# EAGLE design McManis_BJT_H-Bridge_v006 (EAGLE 7.1.0)
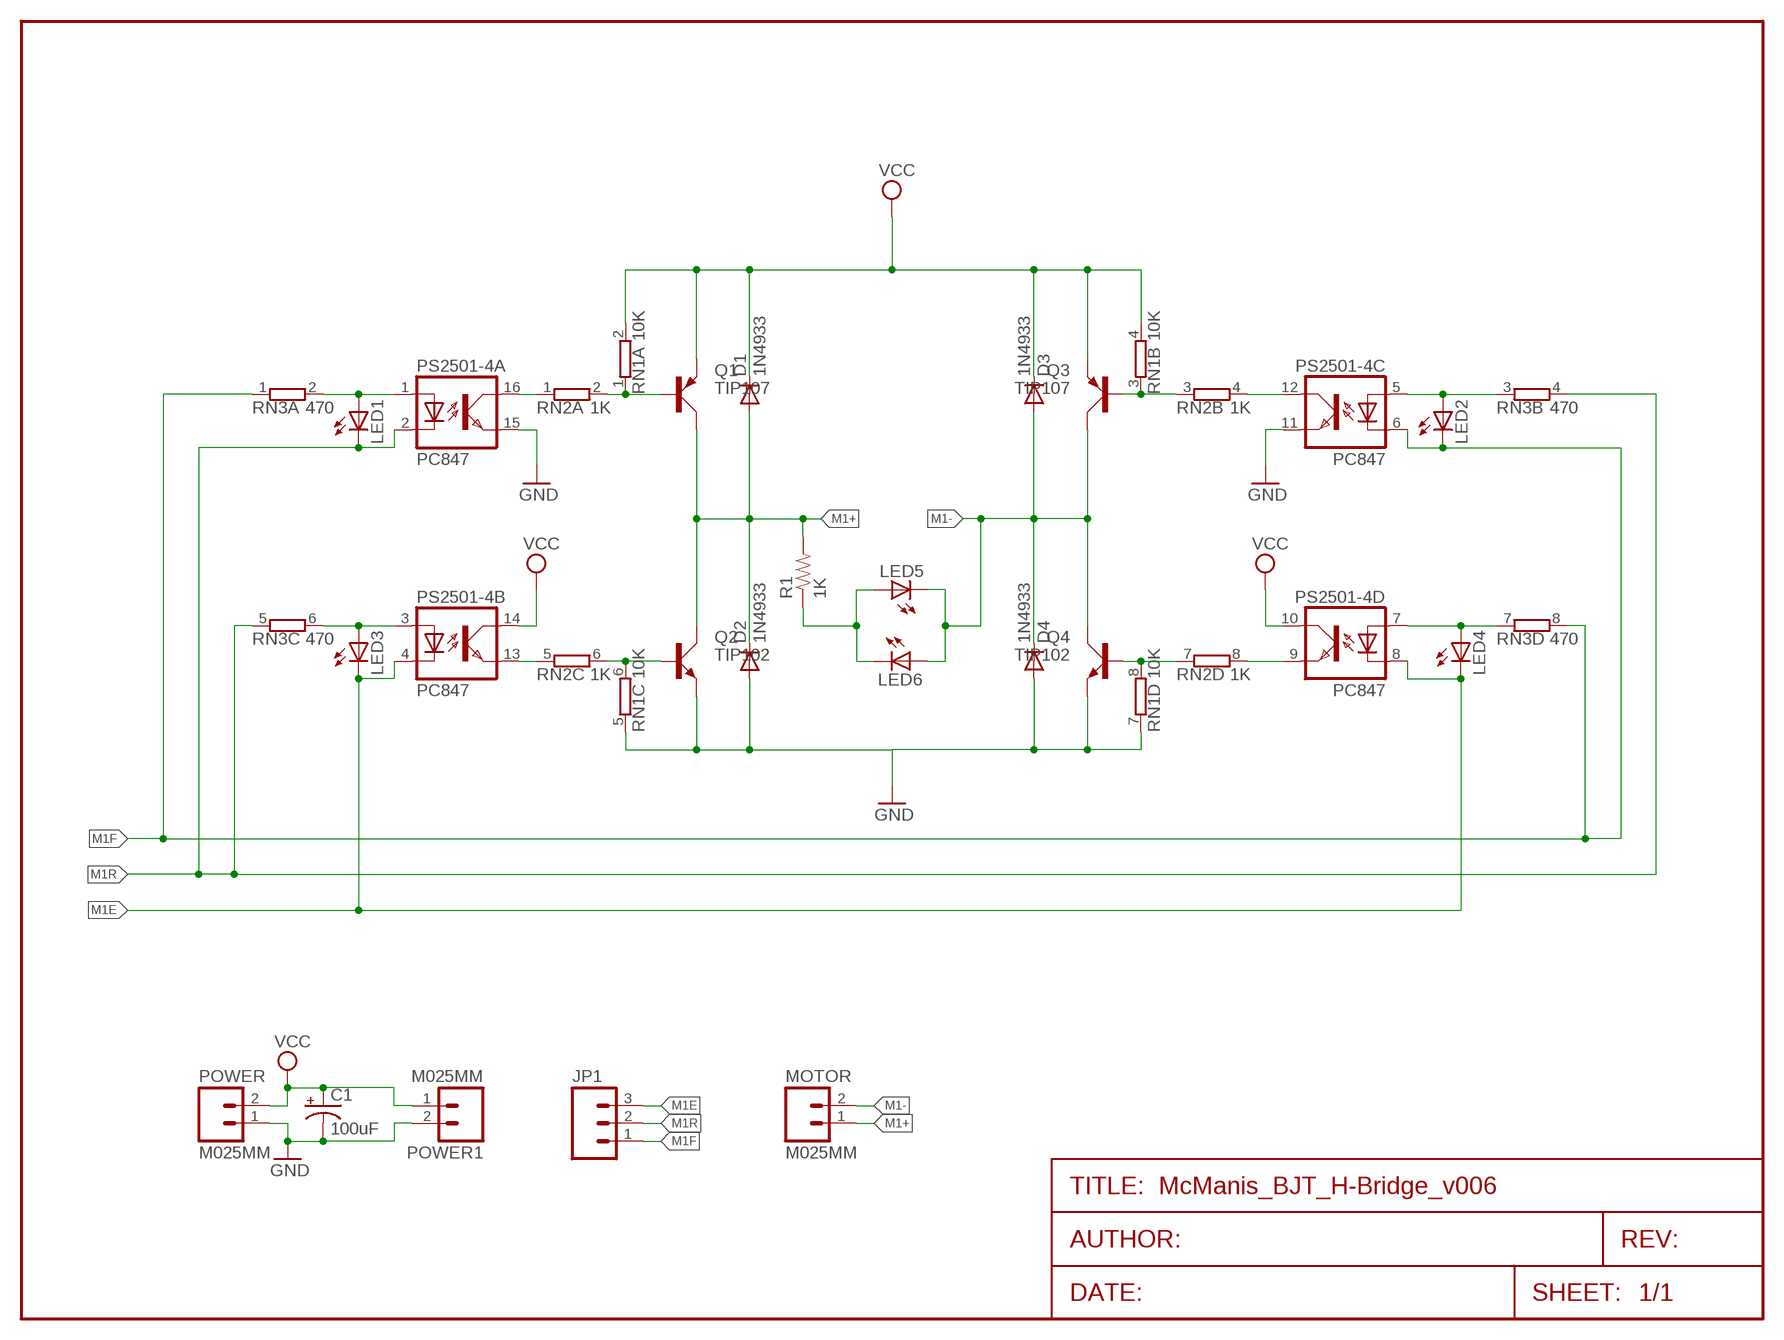
[diagram p0: schematic, sheet 1]

## Parts
C1  100uF  CAP_POLPTH1  [CPOL-RADIAL-100UF-25V]
D1  1N4933  [DO41-10]
D2  1N4933  [DO41-10]
D3  1N4933  [DO41-10]
D4  1N4933  [DO41-10]
JP1  M03PTH  [1X03]
LED1  LED3MM  [LED3MM]
LED2  LED3MM  [LED3MM]
LED3  LED3MM  [LED3MM]
LED4  LED3MM  [LED3MM]
LED5  LED3MM  [LED3MM]
LED6  LED3MM  [LED3MM]
MOTOR  M025MM  [SCREWTERMINAL-5MM-2]
POWER  M025MM  [SCREWTERMINAL-5MM-2]
POWER1  M025MM  [SCREWTERMINAL-5MM-2]
PS2501-4  PC847  [DIL16]
Q1  TIP107  TIP42C  [TO220AV]
Q2  TIP102  TIP41C  [TO220AV]
Q3  TIP107  TIP42C  [TO220AV]
Q4  TIP102  TIP41C  [TO220AV]
R1  1K  RESISTORPTH-1/4W  [AXIAL-0.4]
RN1  10K  E4R  [SIL8]
RN2  1K  E4R  [SIL8]
RN3  470  E4R  [SIL8]

## Nets
GND [Power]: C1.2(-) D2.A D4.A POWER1.2 POWER.1 PS2501-4.11(C:EMIT) PS2501-4.15(A:EMIT) Q2.E Q4.E RN1.5 RN1.7
M1+ [Power]: D1.A D2.C MOTOR.1 Q1.C Q2.C R1.P$2
M1- [Power]: D3.A D4.C LED5.K(C) LED6.A MOTOR.2 Q3.C Q4.C
M1E: JP1.3 LED3.K(C) LED4.K(C) PS2501-4.4(B:C) PS2501-4.8(D:C)
M1F: JP1.1 LED2.K(C) PS2501-4.6(C:C) RN3.1 RN3.8
M1R: JP1.2 LED1.K(C) PS2501-4.2(A:C) RN3.4 RN3.5
N$1: Q2.B RN1.6 RN2.6
N$2: Q1.B RN1.1 RN2.2
N$3: PS2501-4.16(A:COL) RN2.1
N$4: PS2501-4.13(B:EMIT) RN2.5
N$5: Q4.B RN1.8 RN2.7
N$6: Q3.B RN1.3 RN2.3
N$7: PS2501-4.9(D:EMIT) RN2.8
N$8: PS2501-4.12(C:COL) RN2.4
N$9: LED1.A PS2501-4.1(A:A) RN3.2
N$10: LED3.A PS2501-4.3(B:A) RN3.6
N$11: LED4.A PS2501-4.7(D:A) RN3.7
N$12: LED2.A PS2501-4.5(C:A) RN3.3
N$17: LED5.A LED6.K(C) R1.P$1
VCC [Power]: C1.1(+) D1.C D3.C POWER1.1 POWER.2 PS2501-4.10(D:COL) PS2501-4.14(B:COL) Q1.E Q3.E RN1.2 RN1.4

## Library data of the parts
C1 = SparkFun-Passives:CAP_POL: Capacitor Polarized These are standard SMD and PTH capacitors. Normally 10uF, 47uF, and 100uF in electrolytic and tantalum varieties. Always verify the external diameter of the through hole cap, it varies with capacity, voltage, and manufacturer. The EIA devices should be standard.
D1-D4 = diode:1N4933: DIODE fast recovery rectifier, 1A
JP1 = SparkFun-Connectors:M03: Header 3 Standard 3-pin 0.1" header. Use with straight break away headers (SKU : PRT-00116), right angle break away headers (PRT-00553), swiss pins (PRT-00743), machine pins (PRT-00117), and female headers (PRT-00115). Molex polarized connector foot print use with SKU : PRT-08232 with associated crimp pins and housings.
LED1-LED6 = SparkFun-LED:LED: LEDs Standard schematic elements and footprints for 5mm, 3mm, 1206, and 0603 sized LEDs. 5mm - Spark Fun Electronics SKU : COM-00529 (and others)
MOTOR POWER POWER1 = SparkFun-Connectors:M02: Standard 2-pin 0.1" header. Use with - straight break away headers ( PRT-00116) - right angle break away headers (PRT-00553) - swiss pins (PRT-00743) - machine pins (PRT-00117) - female headers (PRT-00115) Molex polarized connector foot print use with: PRT-08233 with associated crimp pins and housings. 2.54_SCREWTERM for use with PRT-10571. 3.5mm Screw Terminal footprints for PRT-08084 5mm Screw Terminal footprints for use with PRT-08433
PS2501-4 = optocoupler:PC847: SHARP OPTO COUPLER; OC_FARNELL: 9707735; OC_NEWARK: unknown
Q1 Q3 = transistor-power:TIP42C: PNP TRANSISTOR
Q2 Q4 = transistor-power:TIP41C: NPN TRANSISTOR
R1 = SparkFun-Passives:RESISTOR: Resistor Basic schematic elements and footprints for 0603, 1206, and PTH resistors.
RN1-RN3 = resistor-sil:E4R: SIL RESISTOR; OC_FARNELL: unknown; OC_NEWARK: unknown

## Net classes
0 default: width 0.406 mm, clearance 0.406 mm
1 Power: width 1.778 mm, clearance 0.406 mm

## Board
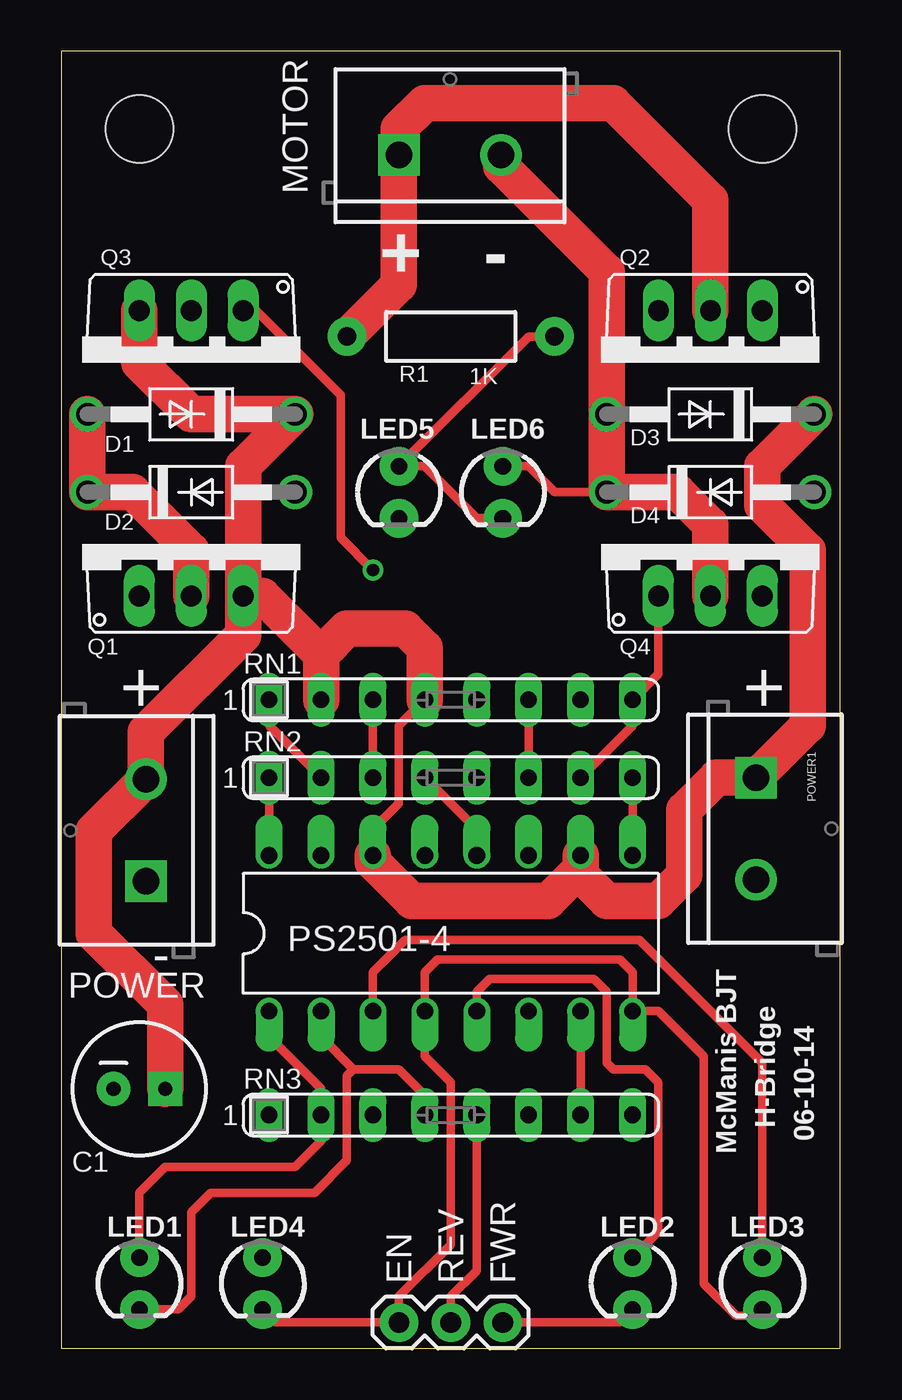
[diagram p1: board, top side]
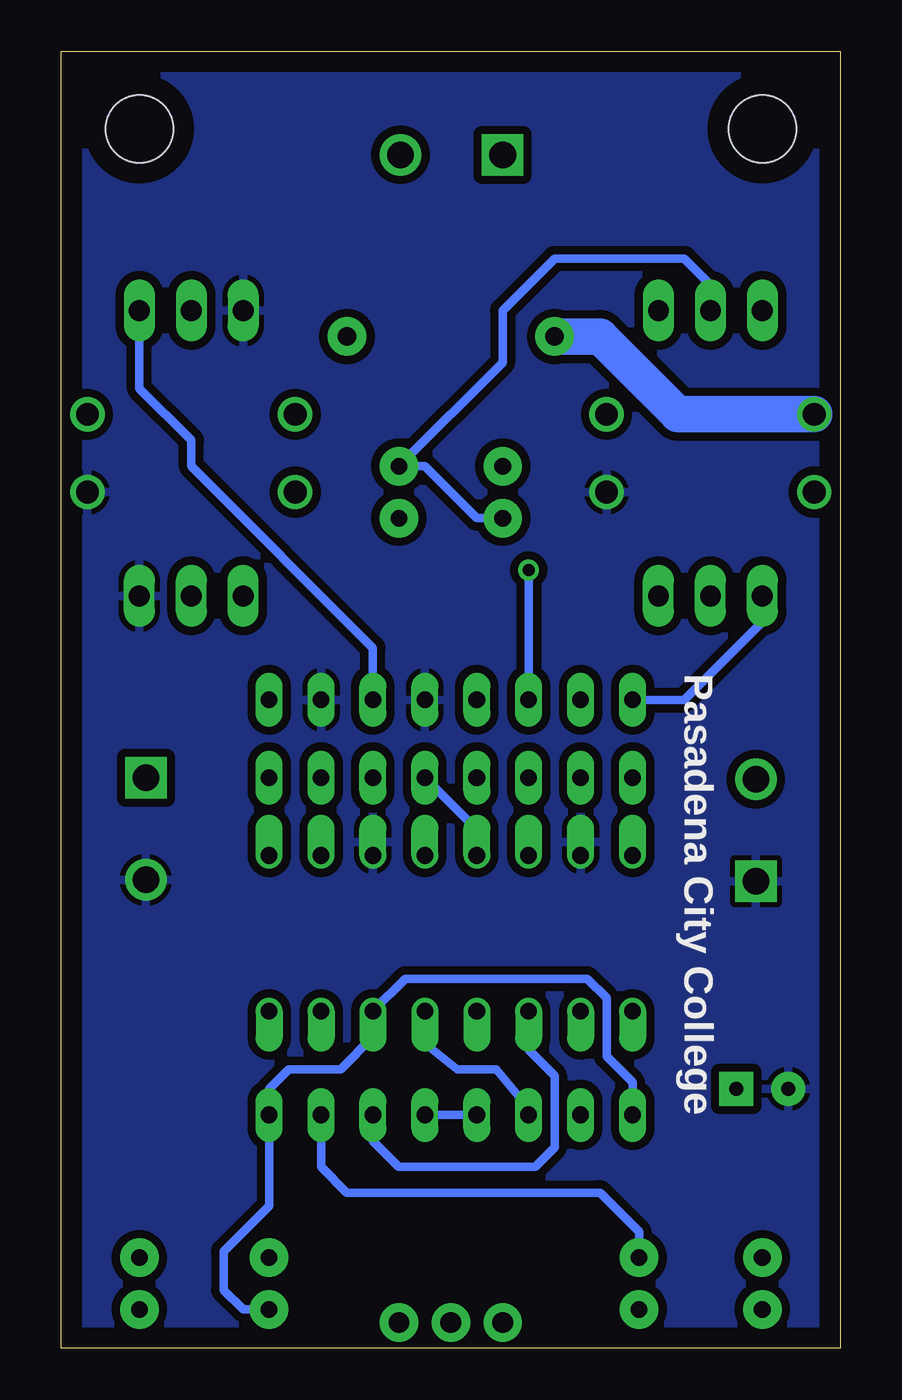
[diagram p2: board, bottom side, seen from below]

Size 38.1 x 63.5 mm. Coordinates in mm from the lower left corner, seen from the top.
Outline: 0,0 38.1,0 38.1,63.5 0,63.5 0,0
Copper layers (1*16): Top 0.035mm / dielectric 1.5mm / Bottom 0.035mm
Design rules "default": minimum track width 10mil, minimum drill 24mil, track to track 8mil, track to pad 8mil, pad to pad 8mil, via to via 8mil, smd to smd 8mil, copper to edge 40mil, drill to drill 8mil, minimum pad ring 10mil, minimum via ring 8mil, stop-mask expansion 4mil, vias tented up to drill 0mil, thermal gap 10mil

### Footprints (pad centres in the part's own frame; a part is rotated, then mirrored left to right if it is on the bottom)
CPOL-RADIAL-100UF-25V = drill 0.7 pad 1.651 square: 1 1.27,0 | drill 0.7 pad 1.651: 2 -1.27,0
DO41-10 = drill 1.118: A 5.08,0; C -5.08,0
1X03 = drill 1.016 pad 1.88: 1 0,0; 2 2.54,0; 3 5.08,0
LED3MM = drill 0.813 pad 1.88: A -1.27,0; K 1.27,0
SCREWTERMINAL-5MM-2 = drill 1.3 pad 2.032 square: 1 0,0 | drill 1.3 pad 2.032: 2 5,0
DIL16 = drill 0.813 offset: 1 -8.89,-3.81; 2 -6.35,-3.81; 3 -3.81,-3.81; 4 -1.27,-3.81; 5 1.27,-3.81; 6 3.81,-3.81; 7 6.35,-3.81; 8 8.89,-3.81; 9 8.89,3.81; 10 6.35,3.81; 11 3.81,3.81; 12 1.27,3.81; 13 -1.27,3.81; 14 -3.81,3.81; 15 -6.35,3.81; 16 -8.89,3.81
TO220AV = drill 1.016 long: B -2.54,-2.54; C 0,-2.54; E 2.54,-2.54
AXIAL-0.4 = drill 0.9 pad 1.88: P$1 -5.08,0; P$2 5.08,0
SIL8 = drill 0.813 long: 1 -8.89,0; 2 -6.35,0; 3 -3.81,0; 4 -1.27,0; 5 1.27,0; 6 3.81,0; 7 6.35,0; 8 8.89,0
STAND-OFF = hole 3.302: 0,0

### Placement (x,y rotation side)
C1  3.81,12.7 0 top
D1  6.35,45.72 180 top
D2  6.35,41.91 0 top
D3  31.75,45.72 180 top
D4  31.75,41.91 0 top
JP1  21.59,1.27 180 top
LED1  3.81,3.17 270 top
LED2  27.94,3.17 270 top
LED3  34.29,3.17 270 top
LED4  9.84,3.17 270 top
LED5  16.51,41.91 270 top
LED6  21.59,41.91 270 top
MOTOR  16.51,58.42 0 top
POWER  4.13,22.86 90 top
POWER1  33.97,27.94 270 top
PS2501-4  19.05,20.32 0 top
Q1  6.35,39.37 0 top
Q2  31.75,48.26 180 top
Q3  6.35,48.26 180 top
Q4  31.75,39.37 0 top
R1  19.05,49.53 180 top
RN1  19.05,31.75 0 top
RN2  19.05,27.94 0 top
RN3  19.05,11.43 0 top
U$1  [STAND-OFF]  3.81,59.69 0 top
U$2  [STAND-OFF]  34.29,59.69 0 top

### Tracks (layer width: path | path; a pad name or v marks a point on that pad's centre or on a via)
GND
  pour Bottom: 0,0 0,63.5 38.1,63.5 38.1,0
M1+
  Top 1.778: D1.A D2.C 3.49,41.91 6.35,39.05 Q1.C | R1.P$2 16.51,52.07 MOTOR.1 16.51,59.69 17.78,60.96 26.99,60.96 31.75,56.2 Q2.C
  Bottom 1.778: R1.P$2 11.75,49.53 7.94,45.72 D1.A
M1-
  Top 0.406: LED6.A 22.86,43.18 24.13,41.91 D4.C
  Top 1.778: MOTOR.2 21.51,57.87 26.67,52.7 D3.A D4.C 30.16,41.91 31.75,40.32 Q4.C
  Bottom 0.406: LED5.K 17.78,40.64 20.32,43.18 LED6.A 16.51,48.26 16.51,50.8 13.97,53.34 7.62,53.34 6.35,52.07 Q3.C
M1E
  Top 0.406: LED4.K 10.48,1.27 JP1.3 16.51,2.54 19.05,5.08 19.05,13.02 17.78,14.29 PS2501-4.4 17.78,18.41 18.41,19.05 27.3,19.05 27.94,18.41 PS2501-4.8 29.21,16.51 31.43,14.29 31.43,3.17 33.02,1.59 33.97,1.59 LED3.K
M1F
  Top 0.406: JP1.1 27.3,1.27 LED2.K
  Bottom 0.406: RN3.1 10.16,13.02 11.43,14.29 11.43,17.14 12.38,18.1 21.27,18.1 PS2501-4.6 22.86,15.24 24.45,13.65 26.99,13.65 27.94,12.7 RN3.8 27.94,6.99 30.16,4.76 30.16,2.86 29.21,1.91 LED2.K
M1R
  Top 0.406: PS2501-4.2 12.7,15.24 14.29,13.65 | 14.29,13.65 16.51,13.65 17.78,12.38 RN3.4 | RN3.5 20.32,3.81 19.05,2.54 JP1.2 | 14.29,13.65 13.97,13.34 13.97,9.21 12.38,7.62 7.3,7.62 6.35,6.67 6.35,2.54 5.71,1.91 LED1.K
  Bottom 0.406: RN3.4 RN3.5
N$1
  Top 0.406: RN2.6 RN1.6
  Bottom 0.406: RN1.6 22.86,34.29 31.75,43.18 31.75,44.45 34.29,46.99 Q2.B
N$2
  Top 0.406: RN1.1 10.16,30.48 RN2.2
  Bottom 0.406: RN1.1 7.62,31.75 3.81,35.56 Q1.B
N$3
  Top 0.406: RN2.1 PS2501-4.16
N$4
  Bottom 0.406: RN2.5 17.78,25.4 PS2501-4.13
N$5
  Top 0.406: RN2.7 27.94,30.48 RN1.8 29.21,33.02 Q4.B
N$6  (via drill 0.6)
  Top 0.406: RN1.3 RN2.3 | Q3.B 9.53,50.8 13.65,46.67 13.65,39.69 v15.24,38.1
  Bottom 0.406: v15.24,38.1 RN1.3
N$7
  Top 0.406: PS2501-4.9 RN2.8
N$8
  Top 0.406: RN2.4 20.32,25.4 PS2501-4.12
N$9
  Top 0.406: PS2501-4.1 10.16,15.24 12.7,12.7 RN3.2 12.7,10.16 11.43,8.89 5.08,8.89 3.81,7.62 LED1.A
N$10
  Top 0.406: PS2501-4.3 15.24,18.41 16.83,20 28.26,20 34.29,13.97 LED3.A
  Bottom 0.406: PS2501-4.3 15.24,14.61 13.97,13.34 13.97,9.84 14.92,8.89 21.59,8.89 22.86,10.16 RN3.6
N$11
  Top 0.406: RN3.7 PS2501-4.7
  Bottom 0.406: RN3.7 25.4,8.89 24.13,7.62 11.75,7.62 9.84,5.71 LED4.A
N$12
  Top 0.406: PS2501-4.5 20.32,17.46 20.95,18.1 26.04,18.1 26.67,17.46 26.67,13.97 26.99,13.65 28.57,13.65 29.21,13.02 29.21,5.71 LED2.A
  Bottom 0.406: RN3.3 15.24,11.75 16.83,13.65 18.73,13.65 20.32,14.92 PS2501-4.5
N$17
  Top 0.406: LED6.K 20.32,40.64 17.78,43.18 LED5.A 22.86,49.53 R1.P$1
VCC
  Top 0.406: PS2501-4.14 15.24,25.4 16.51,26.67 16.51,30.48 RN1.4
  Top 1.778: Q1.E 9.84,36.83 12.7,33.97 | Q1.E 8.89,43.18 D1.C 6.35,45.72 3.81,48.26 Q3.E | PS2501-4.14 15.24,23.81 17.14,21.91 23.81,21.91 25.4,23.5 PS2501-4.10 25.4,23.18 26.67,21.91 29.21,21.91 30.48,23.18 30.48,26.35 32.07,27.94 POWER1.1 36.51,30.48 36.51,39.05 34.29,41.27 34.29,43.18 D3.C | C1.1 5.08,16.83 1.59,20.32 1.59,25.32 POWER.2 4.13,30.16 8.89,34.92 Q1.E | RN1.2 12.7,33.97 | 12.7,33.97 13.97,35.24 16.83,35.24 17.78,34.29 RN1.4

### Text on the board
tPlace: + | - | + | + | - | H-Bridge | McManis BJT | 06-10-14 | EN | REV | FWR
bPlace: Pasadena City College